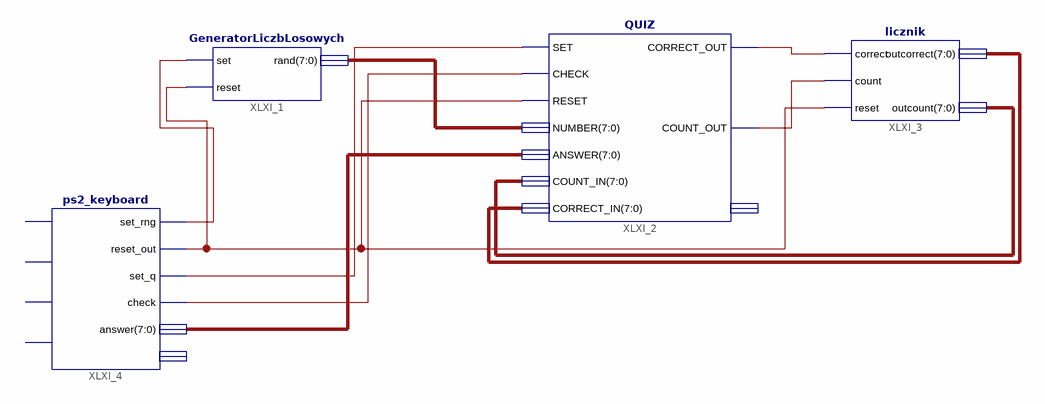
[diagram p0: schematic sheet 1]
// Xilinx ISE schematic core.sch (spartan3e) as structural Verilog: 4 symbols, 0 ports
module core (
);

  wire XLXN_3, XLXN_4, XLXN_8, XLXN_9, XLXN_11, XLXN_12;
  wire [7:0] XLXN_1, XLXN_5, XLXN_6, XLXN_13;

  GeneratorLiczbLosowych XLXI_1 (.set(XLXN_8), .reset(XLXN_9), .\rand (XLXN_1));
  QUIZ XLXI_2 (
    .SET(XLXN_11), .CHECK(XLXN_12), .RESET(XLXN_9), .NUMBER(XLXN_1), .ANSWER(XLXN_13), .COUNT_IN(XLXN_6),
    .CORRECT_IN(XLXN_5), .CORRECT_OUT(XLXN_4), .COUNT_OUT(XLXN_3));  // open: TEXT_OUTPUT
  licznik XLXI_3 (.correct(XLXN_4), .count(XLXN_3), .reset(XLXN_9), .outcorrect(XLXN_5), .outcount(XLXN_6));
  ps2_keyboard XLXI_4 (
    .set_rng(XLXN_8), .reset_out(XLXN_9), .set_q(XLXN_11), .check(XLXN_12), .answer(XLXN_13));  // open: clk, reset, ps2_clk, ps2_data, state_out
endmodule
